# Altium schematic sheet EPS_DCDC_OR.SchDoc: DCDC / ORing
size A4
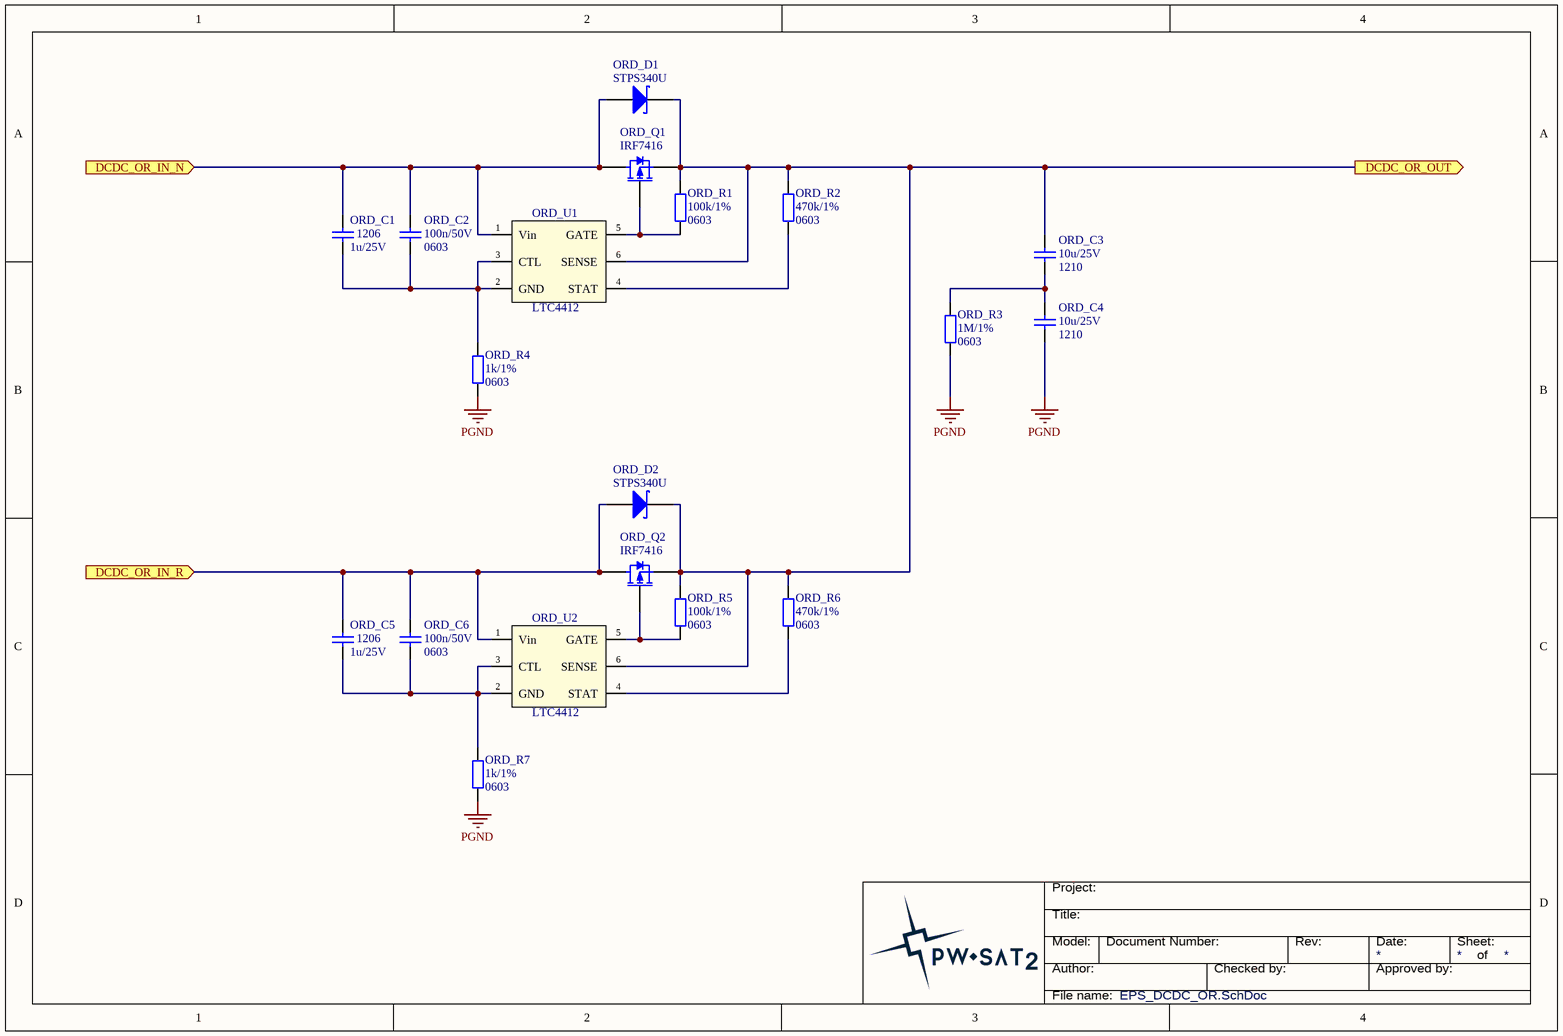
[diagram p0: EPS_DCDC_OR.SchDoc]

## Parts
ORD_C1  Package: 1206  [SMD_Capacitor_1206]  (hidden comment: 1u/25V)
ORD_C2  Package: 0603  [SMD_Capacitor_0603]  (hidden comment: 100n/50V)
ORD_C3  Package: 1210  [SMD_Capacitor_1210]  (hidden comment: 10u/25V)
ORD_C4  Package: 1210  [SMD_Capacitor_1210]  (hidden comment: 10u/25V)
ORD_C5  Package: 1206  [SMD_Capacitor_1206]  (hidden comment: 1u/25V)
ORD_C6  Package: 0603  [SMD_Capacitor_0603]  (hidden comment: 100n/50V)
ORD_D1  STPS340U  [DO-214AA]
ORD_D2  STPS340U  [DO-214AA]
ORD_Q1  IRF7416  [SOIC-8-N_SSSGDDDD]
ORD_Q2  IRF7416  [SOIC-8-N_SSSGDDDD]
ORD_R1  Package: 0603  [SMD_Resistor_0603]  (hidden comment: 100k/1%)
ORD_R2  Package: 0603  [SMD_Resistor_0603]  (hidden comment: 470k/1%)
ORD_R3  Package: 0603  [SMD_Resistor_0603]  (hidden comment: 1M/1%)
ORD_R4  Package: 0603  [SMD_Resistor_0603]  (hidden comment: 1k/1%)
ORD_R5  Package: 0603  [SMD_Resistor_0603]  (hidden comment: 100k/1%)
ORD_R6  Package: 0603  [SMD_Resistor_0603]  (hidden comment: 470k/1%)
ORD_R7  Package: 0603  [SMD_Resistor_0603]  (hidden comment: 1k/1%)
ORD_U1  LTC4412  [SOT23-6]
ORD_U2  LTC4412  [SOT23-6]

## Ports
DCDC_OR_IN_N (in), DCDC_OR_IN_R (in), DCDC_OR_OUT (out)

## Nets
PGND: ORD_C4.2 ORD_R3.2 ORD_R4.1 ORD_R7.1
DCDC_OR_IN_N: ORD_C1.1 ORD_C2.1 ORD_D1.A ORD_Q1.D ORD_U1.1(Vin) ; port DCDC_OR_IN_N
DCDC_OR_IN_R: ORD_C5.1 ORD_C6.1 ORD_D2.A ORD_Q2.D ORD_U2.1(Vin) ; port DCDC_OR_IN_R
DCDC_OR_OUT: ORD_C3.1 ORD_D1.K ORD_D2.K ORD_Q1.S ORD_Q2.S ORD_R1.2 ORD_R2.2 ORD_R5.2 ORD_R6.2 ORD_U1.6(SENSE) ORD_U2.6(SENSE) ; port DCDC_OR_OUT
NetORD_C1_2: ORD_C1.2 ORD_C2.2 ORD_R4.2 ORD_U1.2(GND) ORD_U1.3(CTL)
NetORD_C3_2: ORD_C3.2 ORD_C4.1 ORD_R3.1
NetORD_C5_2: ORD_C5.2 ORD_C6.2 ORD_R7.2 ORD_U2.2(GND) ORD_U2.3(CTL)
NetORD_Q1_G: ORD_Q1.G ORD_R1.1 ORD_U1.5(GATE)
NetORD_Q2_G: ORD_Q2.G ORD_R5.1 ORD_U2.5(GATE)
NetORD_R2_1: ORD_R2.1 ORD_U1.4(STAT)
NetORD_R6_1: ORD_R6.1 ORD_U2.4(STAT)

## Notes on the sheet
- Title:
- Project:
- Author:
- Model:
- Document Number:
- Checked by:
- Rev:
- Date:
- Approved by:
- Sheet:
- of
- File name:

## Library data of the parts
ORD_C1 ORD_C5 = Cer_C1206T105K3RALTU: Ceramic Cap Kemet COTS 1u/25V X7R 1206; ManufacturerPartNumber: C1206T105K3RALTU; Manufacturer: Kemet; Value: 1u/25V
ORD_C2 ORD_C6 = Cer_GCJ188R71H104KA12D: Ceramic Cap Murata Automotive 100n/50V X7R 0603; Manufacturer: Murata; ManufacturerPartNumber: GCJ188R71H104KA12D; Value: 100n/50V
ORD_C3 ORD_C4 = Cer_GCJ32ER71E106KA12L: Ceramic Cap Murata Automotive 10u/25V X7R 1210; Manufacturer: Murata; ManufacturerPartNumber: GCJ32ER71E106KA12L; Value: 10u/25V
ORD_D1 ORD_D2 = STPS340x: 3A/40V Power Schottky Rectifier.; Manufacturer: STMicroelectronics; Value: STPS340U
ORD_Q1 ORD_Q2 = IRF7416: 10A/30V HEXFET Power P-MOSFET.; Manufacturer: International Rectifier; Value: IRF7416
ORD_R1-ORD_R7 = Res
  ORD_R1 ORD_R5: Value: 100k/1%
  ORD_R2 ORD_R6: Value: 470k/1%
  ORD_R3: Value: 1M/1%
  ORD_R4 ORD_R7: Value: 1k/1%
ORD_U1 ORD_U2 = LTC4412: Ideal Diode, Low Loss PowerPath Controller.; Manufacturer: Linear Technology; Value: LTC4412